# Altium schematic sheet SignalBundling.SchDoc
size A4; CompanyName: Technische Hochschule Nürnberg Georg Simon Ohm; Address1: Fürther Straße 250; Address2: 90429 Nürnberg; Address3: GERMANY; DocumentNumber: 10; SheetNumber: 10; SheetTotal: 16; CompanyName2: Institut ELSYS
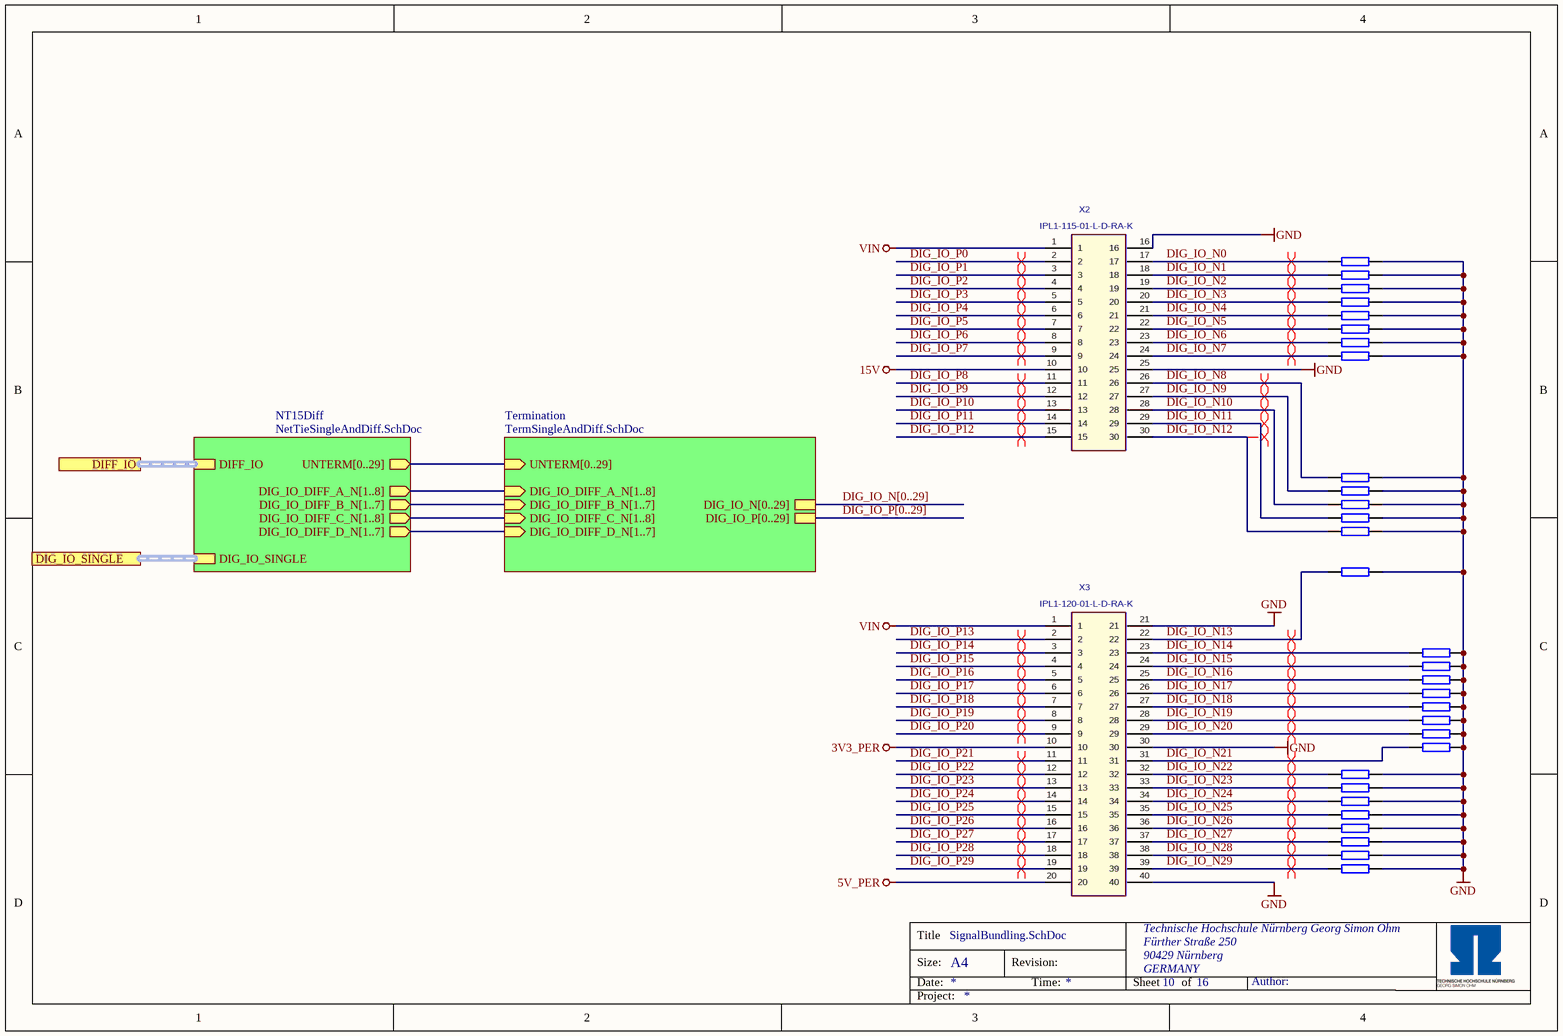
[diagram p0: SignalBundling.SchDoc]

## Parts
R21  0R  [RES 0603_1608]  (value not drawn)
R22  0R  [RES 0603_1608]  (value not drawn)
R23  0R  [RES 0603_1608]  (value not drawn)
R24  0R  [RES 0603_1608]  (value not drawn)
R25  0R  [RES 0603_1608]  (value not drawn)
R26  0R  [RES 0603_1608]  (value not drawn)
R27  0R  [RES 0603_1608]  (value not drawn)
R28  0R  [RES 0603_1608]  (value not drawn)
R29  0R  [RES 0603_1608]  (value not drawn)
R30  0R  [RES 0603_1608]  (value not drawn)
R31  0R  [RES 0603_1608]  (value not drawn)
R32  0R  [RES 0603_1608]  (value not drawn)
R33  0R  [RES 0603_1608]  (value not drawn)
R34  0R  [RES 0603_1608]  (value not drawn)
R35  0R  [RES 0603_1608]  (value not drawn)
R36  0R  [RES 0603_1608]  (value not drawn)
R37  0R  [RES 0603_1608]  (value not drawn)
R38  0R  [RES 0603_1608]  (value not drawn)
R39  0R  [RES 0603_1608]  (value not drawn)
R40  0R  [RES 0603_1608]  (value not drawn)
R41  0R  [RES 0603_1608]  (value not drawn)
R42  0R  [RES 0603_1608]  (value not drawn)
R43  0R  [RES 0603_1608]  (value not drawn)
R44  0R  [RES 0603_1608]  (value not drawn)
R45  0R  [RES 0603_1608]  (value not drawn)
R46  0R  [RES 0603_1608]  (value not drawn)
R47  0R  [RES 0603_1608]  (value not drawn)
R48  0R  [RES 0603_1608]  (value not drawn)
R49  0R  [RES 0603_1608]  (value not drawn)
R50  0R  [RES 0603_1608]  (value not drawn)
X2  IPL1-115-01-L-D-RA-K  [IPL1-115-01-XX-D-RA]
X3  IPL1-120-01-L-D-RA-K  [IPL1-120-01-XX-D-RA]

## Sub-sheets
NT15Diff = NetTieSingleAndDiff.SchDoc: DIG_IO_DIFF_B_N[1..7] (out), UNTERM[0..29] (out), DIG_IO_DIFF_D_N[1..7] (out), DIG_IO_DIFF_C_N[1..8] (out), DIG_IO_DIFF_A_N[1..8] (out), DIFF_IO (harness DIFF_IO), DIG_IO_SINGLE (harness DIG_IO_SINGLE)
Termination = TermSingleAndDiff.SchDoc: UNTERM[0..29] (in), DIG_IO_DIFF_A_N[1..8] (in), DIG_IO_DIFF_C_N[1..8] (in), DIG_IO_DIFF_B_N[1..7] (in), DIG_IO_DIFF_D_N[1..7] (in), DIG_IO_P[0..29], DIG_IO_N[0..29]

## Ports
DIFF_IO (harness DIFF_IO), DIG_IO_SINGLE (harness DIG_IO_SINGLE)

## Nets
3V3_PER: X3.10
5V_PER: X3.20
15V: X2.10
GND: R21.2 R22.2 R23.2 R24.2 R25.2 R26.2 R27.2 R28.2 R29.2 R30.2 R31.2 R32.2 R33.2 R34.2 R35.2 R36.2 R37.2 R38.2 R39.2 R40.2 R41.2 R42.2 R43.2 R44.2 R45.2 R46.2 R47.2 R48.2 R49.2 R50.2 X2.16 X2.25 X3.21 X3.30 X3.40
VIN: X2.1 X3.1
DIG_IO_N0: R21.1 X2.17
DIG_IO_N1: R22.1 X2.18
DIG_IO_N2: R23.1 X2.19
DIG_IO_N3: R24.1 X2.20
DIG_IO_N4: R25.1 X2.21
DIG_IO_N5: R26.1 X2.22
DIG_IO_N6: R27.1 X2.23
DIG_IO_N7: R28.1 X2.24
DIG_IO_N8: R29.1 X2.26
DIG_IO_N9: R30.1 X2.27
DIG_IO_N10: R31.1 X2.28
DIG_IO_N11: R32.1 X2.29
DIG_IO_N12: R33.1 X2.30
DIG_IO_N13: R34.1 X3.22
DIG_IO_N14: R35.1 X3.23
DIG_IO_N15: R36.1 X3.24
DIG_IO_N16: R37.1 X3.25
DIG_IO_N17: R38.1 X3.26
DIG_IO_N18: R39.1 X3.27
DIG_IO_N19: R40.1 X3.28
DIG_IO_N20: R41.1 X3.29
DIG_IO_N21: R42.1 X3.31
DIG_IO_N22: R43.1 X3.32
DIG_IO_N23: R44.1 X3.33
DIG_IO_N24: R45.1 X3.34
DIG_IO_N25: R46.1 X3.35
DIG_IO_N26: R47.1 X3.36
DIG_IO_N27: R48.1 X3.37
DIG_IO_N28: R49.1 X3.38
DIG_IO_N29: R50.1 X3.39
DIG_IO_P0: X2.2
DIG_IO_P1: X2.3
DIG_IO_P2: X2.4
DIG_IO_P3: X2.5
DIG_IO_P4: X2.6
DIG_IO_P5: X2.7
DIG_IO_P6: X2.8
DIG_IO_P7: X2.9
DIG_IO_P8: X2.11
DIG_IO_P9: X2.12
DIG_IO_P10: X2.13
DIG_IO_P11: X2.14
DIG_IO_P12: X2.15
DIG_IO_P13: X3.2
DIG_IO_P14: X3.3
DIG_IO_P15: X3.4
DIG_IO_P16: X3.5
DIG_IO_P17: X3.6
DIG_IO_P18: X3.7
DIG_IO_P19: X3.8
DIG_IO_P20: X3.9
DIG_IO_P21: X3.11
DIG_IO_P22: X3.12
DIG_IO_P23: X3.13
DIG_IO_P24: X3.14
DIG_IO_P25: X3.15
DIG_IO_P26: X3.16
DIG_IO_P27: X3.17
DIG_IO_P28: X3.18
DIG_IO_P29: X3.19

## Buses and harness runs
bus DIG_IO_N[0..29] = sheet Termination/DIG_IO_N[0..29]
bus DIG_IO_P[0..29] = sheet Termination/DIG_IO_P[0..29]
bus sheet NT15Diff/DIG_IO_DIFF_A_N[1..8] = sheet Termination/DIG_IO_DIFF_A_N[1..8]
bus sheet NT15Diff/DIG_IO_DIFF_B_N[1..7] = sheet Termination/DIG_IO_DIFF_B_N[1..7]
bus sheet NT15Diff/DIG_IO_DIFF_C_N[1..8] = sheet Termination/DIG_IO_DIFF_C_N[1..8]
bus sheet NT15Diff/DIG_IO_DIFF_D_N[1..7] = sheet Termination/DIG_IO_DIFF_D_N[1..7]
bus sheet NT15Diff/UNTERM[0..29] = sheet Termination/UNTERM[0..29]
harness port DIFF_IO = sheet NT15Diff/DIFF_IO
harness port DIG_IO_SINGLE = sheet NT15Diff/DIG_IO_SINGLE

## Layout directives
differential pair: DIG_IO_N0, DIG_IO_N1, DIG_IO_N2, DIG_IO_N3, DIG_IO_N4, DIG_IO_N5, DIG_IO_N6, DIG_IO_N7, DIG_IO_N8, DIG_IO_N9, DIG_IO_N10, DIG_IO_N11, DIG_IO_N12, DIG_IO_N13, DIG_IO_N14, DIG_IO_N15, DIG_IO_N16, DIG_IO_N17, DIG_IO_N18, DIG_IO_N19, DIG_IO_N20, DIG_IO_N21, DIG_IO_N22, DIG_IO_N23, DIG_IO_N24, DIG_IO_N25, DIG_IO_N26, DIG_IO_N27, DIG_IO_N28, DIG_IO_N29, DIG_IO_P0, DIG_IO_P1, DIG_IO_P2, DIG_IO_P3, DIG_IO_P4, DIG_IO_P5, DIG_IO_P6, DIG_IO_P7, DIG_IO_P8, DIG_IO_P9, DIG_IO_P10, DIG_IO_P11, DIG_IO_P12, DIG_IO_P13, DIG_IO_P14, DIG_IO_P15, DIG_IO_P16, DIG_IO_P17, DIG_IO_P18, DIG_IO_P19, DIG_IO_P20, DIG_IO_P21, DIG_IO_P22, DIG_IO_P23, DIG_IO_P24, DIG_IO_P25, DIG_IO_P26, DIG_IO_P27, DIG_IO_P28, DIG_IO_P29

## Notes on the sheet
- Title
- Size:
- Date:
- A4
- Revision:
- Time:
- Sheet
- of
- Author:
- Project:

## Library data of the parts
R21-R50 = RC0603JR-070RL: SMD resistor E24 series; Manufacturer: YAGEO; Tolerance: 5%; Created from: MGremer; Manufacturer Part Number: RC0603JR-070RL; PartID: 1; Created On: 14.12.2020 16:17:14; ComponentLink1Description: Datasheet; ComponentLink1URL: https://www.mouser.de/datasheet/2/447/PYu-RC_Group_51_RoHS_L_10-1664068.pdf; Component Type: SMD resistor; Device Package: 0603; Last Updated: 04.03.2021 09:09:42; Mounting Type: SMD; Supplier 1: Mouser; Supplier Part Number 1: 603-RC0603JR-070RL; Type: Resistor; Value: 0R; Live Cycle Status: 1; Stock number: Labor SMD Container; LCSC Part Number: C21189; Supplier 2: LCSC; Supplier Part Number 2: C21189
X2 = IPL1-115-01-L-D-RA-K: Terminal Assembly, Double Row, Right Angle, Thru-Hole, 2.54 mm x 2.54 mm Pitch, 30 Pins; Manufacturer: SAMTEC; Created from: TWendt; Number of positions: 30; Manufacturer Part Number: IPL1-115-01-L-D-RA-K; PartID: 34; Created On: 12.02.2021 15:31:18; ComponentLink1Description: Homepage; ComponentLink1URL: https://www.samtec.com/products/ipl1; Component Type: Samtec Connector; Device Package: Connector; Last Updated: 15.02.2021 10:07:42; Supplier 1: SAMTEC; Supplier Part Number 1: IPL1-115-01-L-D-RA-K; Type: Connector; Live Cycle Status: 1; Number of rows: 2; Stock number: not stored
X3 = IPL1-120-01-L-D-RA-K: Terminal Assembly, Double Row, Right Angle, Thru-Hole, 2.54 mm x 2.54 mm Pitch, 40 Pins; Manufacturer: SAMTEC; Created from: TWendt; Number of positions: 40; Manufacturer Part Number: IPL1-120-01-L-D-RA-K; PartID: 33; Created On: 12.02.2021 15:26:11; ComponentLink1Description: Homepage; ComponentLink1URL: https://www.samtec.com/products/ipl1; Component Type: Samtec Connector; Device Package: Connector; Last Updated: 15.02.2021 10:07:42; Mounting Type: THT; Supplier 1: SAMTEC; Supplier Part Number 1: IPL1-120-01-L-D-RA-K; Type: Connector; Live Cycle Status: 1; Number of rows: 2; Stock number: not stored